# Altium schematic sheet 崔文轩.SchDoc
size A0
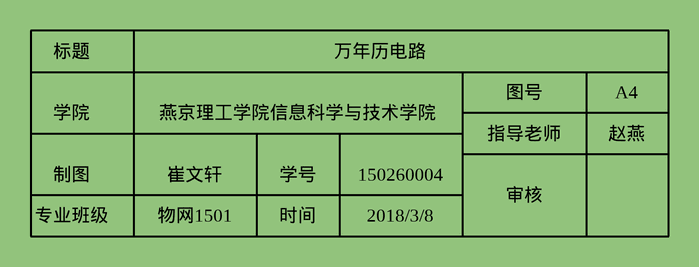
[diagram p0: 崔文轩.SchDoc]

## Notes on the sheet
- 标题
- 万年历电路
- 学院
- 燕京理工学院信息科学与技术学院
- 图号
- 指导老师
- A4
- 赵燕
- 制图
- 专业班级
- 崔文轩
- 物网1501
- 学号
- 时间
- 150260004
- 2018/3/8
- 审核